# Altium project Circuito2.PrjPcb
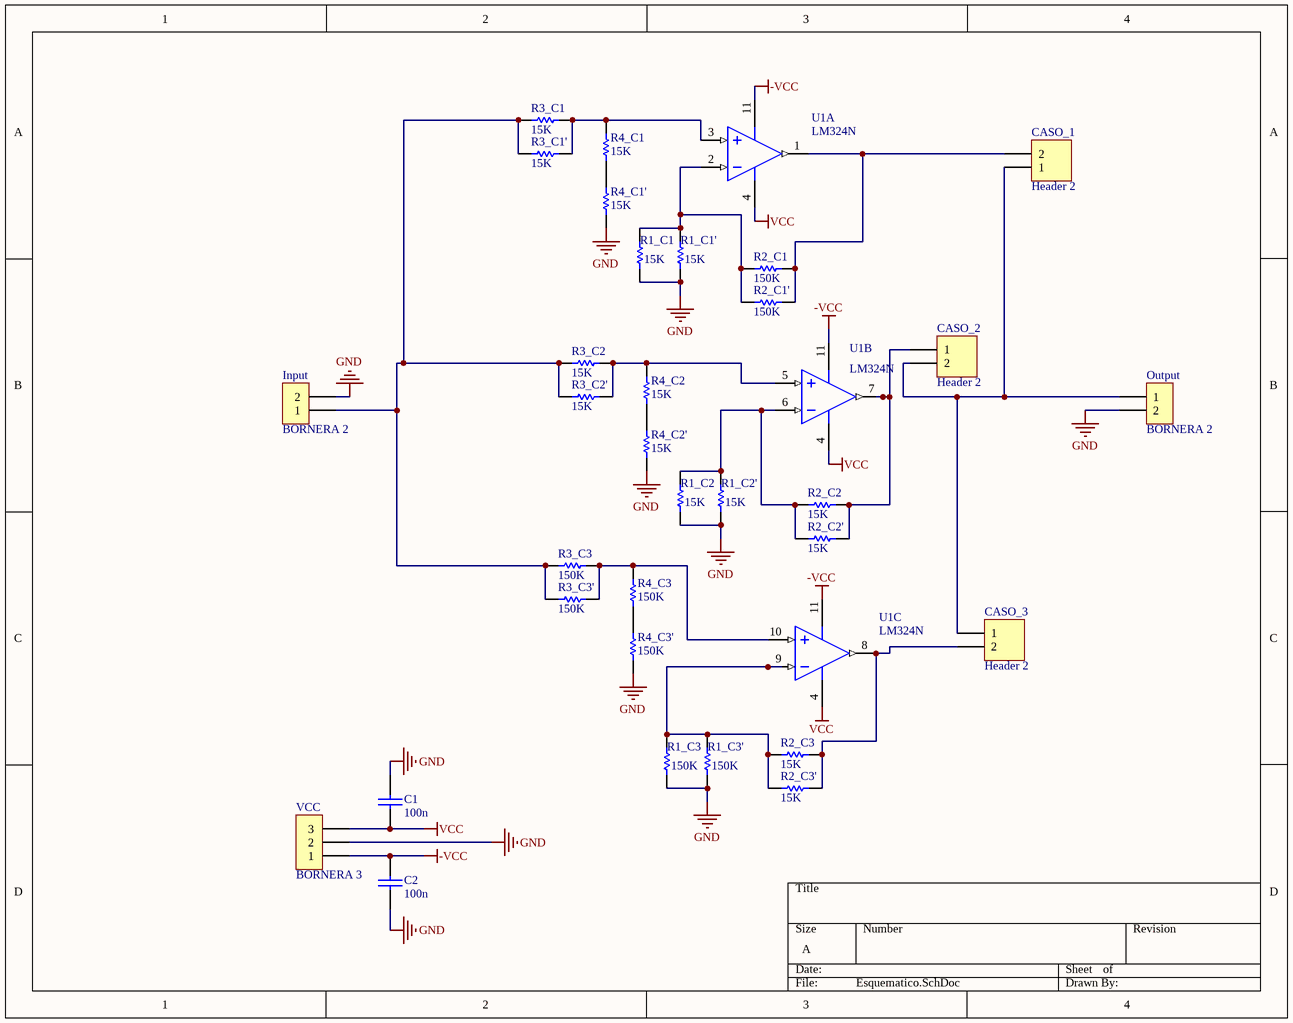
[diagram p0: Esquematico.SchDoc]
1 sheet, 33 parts. Net scope: global (net labels, ports and power ports of the same name join across sheets).
Board file: PCB1.PcbDoc

## Sheet Esquematico.SchDoc
size A

### Parts
C1  100n  [CAP100]
C2  100n  [CAP100]
CASO_1  Header 2  [HDR1X2]
CASO_2  Header 2  [HDR1X2]
CASO_3  Header 2  [HDR1X2]
Input  BORNERA 2  [BORNERA2]
Output  BORNERA 2  [BORNERA2]
R1_C1  15K  [RES400]
R1_C1'  15K  [RES400]
R1_C2  15K  [RES400]
R1_C2'  15K  [RES400]
R1_C3  150K  [RES400]
R1_C3'  150K  [RES400]
R2_C1  150K  [RES400]
R2_C1'  150K  [RES400]
R2_C2  15K  [RES400]
R2_C2'  15K  [RES400]
R2_C3  15K  [RES400]
R2_C3'  15K  [RES400]
R3_C1  15K  [RES400]
R3_C1'  15K  [RES400]
R3_C2  15K  [RES400]
R3_C2'  15K  [RES400]
R3_C3  150K  [RES400]
R3_C3'  150K  [RES400]
R4_C1  15K  [RES400]
R4_C1'  15K  [RES400]
R4_C2  15K  [RES400]
R4_C2'  15K  [RES400]
R4_C3  150K  [RES400]
R4_C3'  150K  [RES400]
U1  LM324N  [N14A]  (parts A,B,C of 4)
VCC  BORNERA 3  [BORNERA3]

### Nets
-VCC: C2.1 U1.11(GND) VCC.1
GND: C1.1 C2.2 Input.2 Output.2 R1_C1.1 R1_C1'.1 R1_C2.1 R1_C2'.1 R1_C3.1 R1_C3'.1 R4_C1'.1 R4_C2'.1 R4_C3'.1 VCC.2
VCC: C1.2 U1.4(V+) VCC.3
NetCASO_1_1: CASO_1.1 CASO_2.2 CASO_3.1 Output.1
NetCASO_1_2: CASO_1.2 R2_C1.1 R2_C1'.1 U1.1(OUT1)
NetCASO_2_1: CASO_2.1 R2_C2.1 R2_C2'.1 U1.7(OUT2)
NetCASO_3_2: CASO_3.2 R2_C3.1 R2_C3'.1 U1.8(OUT3)
NetInput_1: Input.1 R3_C1.1 R3_C1'.1 R3_C2.1 R3_C2'.1 R3_C3.1 R3_C3'.1
NetR1_C1_2: R1_C1.2 R1_C1'.2 R2_C1.2 R2_C1'.2 U1.2(IN1-)
NetR1_C2_2: R1_C2.2 R1_C2'.2 R2_C2.2 R2_C2'.2 U1.6(IN2-)
NetR1_C3_2: R1_C3.2 R1_C3'.2 R2_C3.2 R2_C3'.2 U1.9(IN3-)
NetR3_C1_2: R3_C1.2 R3_C1'.2 R4_C1.2 U1.3(IN1+)
NetR3_C2_2: R3_C2.2 R3_C2'.2 R4_C2.2 U1.5(IN2+)
NetR3_C3_2: R3_C3.2 R3_C3'.2 R4_C3.2 U1.10(IN3+)
NetR4_C1_1: R4_C1.1 R4_C1'.2
NetR4_C2_1: R4_C2.1 R4_C2'.2
NetR4_C3_1: R4_C3.1 R4_C3'.2

### Library data of the parts
C1 C2 = CAP
CASO_1-CASO_3 = Header 2: Header, 2-Pin; LatestRevisionDate: 17-Jul-2002; LatestRevisionNote: Re-released for DXP Platform.; Publisher: Altium Limited
R1_C1 R1_C1' R1_C2 R1_C2' R1_C3 R1_C3' R2_C1 R2_C1' R2_C2 R2_C2' R2_C3 R2_C3' R3_C1 R3_C1' R3_C2 R3_C2' R3_C3 R3_C3' R4_C1 R4_C1' R4_C2 R4_C2' R4_C3 R4_C3' = RES
U1 = LM324N: Low Power Quad Operational Amplifier, 14-pin MDIP; Manufacturer: National Semiconductor; PackageTopMarking: NSUZXYYTTE#*LM324N; PowerWise: N; CompType: Amplifiers; Published: 4-Dec-2008; LatestRevisionDate: 13-Jan-2009; LatestRevisionNote: Sim Model Added.; DatasheetVersion: Aug-2000; PackageVersion: revG, May-2006; PackageReference: N14A; Publisher: Altium Limited; PackageDescription: MDIP, .750 x .250 x.130in, 14 Lead, .100in Pitch; PartNumber: LM324N; RoHS: N; PinCount: 14; Code_JEDEC: MS-001-AA; ComponentLink1Description: LM324 Datasheet; ComponentLink1URL: http://www.national.com/ds/LM/LM324.pdf; ComponentLink2Description: LM324 Web Page; ComponentLink2URL: http://www.national.com/pf/LM/LM324.html; ComponentLink3Description: N14A Package Page; ComponentLink3URL: http://www.national.com/packaging/folders/n14a.html